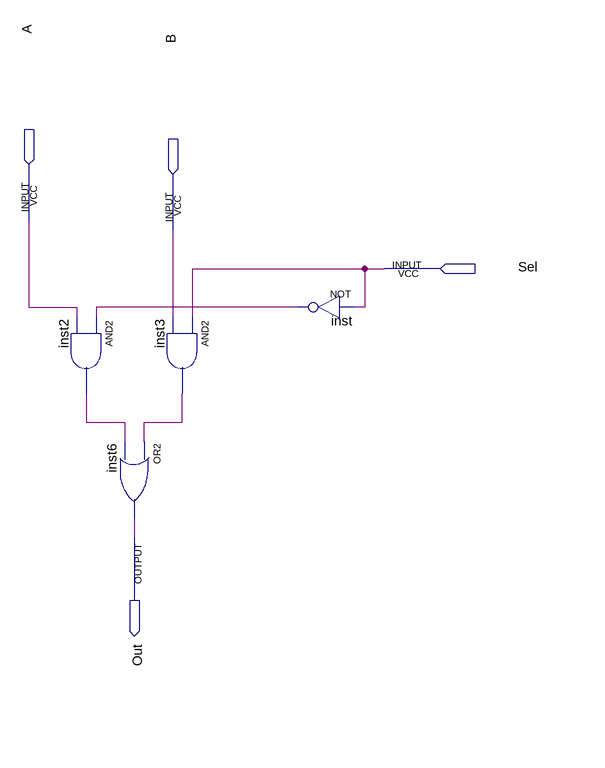
[diagram p0: schematic sheet]
// Quartus schematic MUX 2x1.bdf as structural Verilog: 4 symbols, 4 pins
module \MUX_2x1  (
  input  A,
  input  B,
  input  Sel,
  output Out
);

  wire inst2_out, inst3_out, inst_out;

  and inst2 (inst2_out, inst_out, A);
  or inst6 (Out, inst3_out, inst2_out);
  and inst3 (inst3_out, Sel, B);
  not inst (inst_out, Sel);
endmodule
